# Altium schematic sheet Gate_Driver.SchDoc
size A3
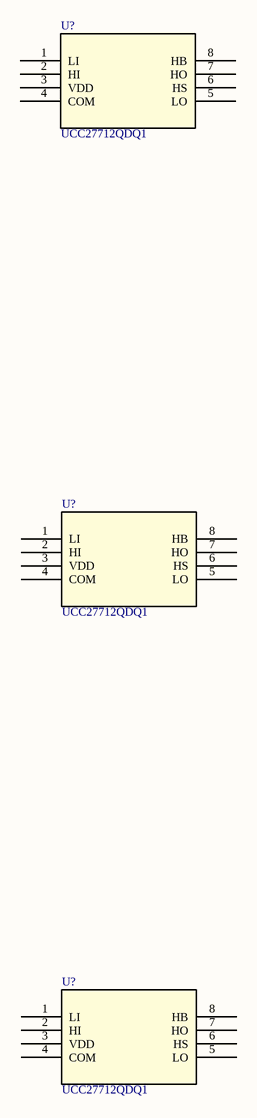
[diagram p0: Gate_Driver.SchDoc]

## Parts
(Parts that share a designator on the sheet are numbered #1, #2 ... from top to bottom, then left to right.)
U?#1  UCC27712QDQ1  [SOIC127P570X175_HS-9N]
U?#2  UCC27712QDQ1  [SOIC127P570X175_HS-9N]
U?#3  UCC27712QDQ1  [SOIC127P570X175_HS-9N]

## Nets

Not connected (* = marked no-connect by the designer): U?#1 1(LI) 2(HI) 3(VDD) 4(COM) 5(LO) 6(HS) 7(HO) 8(HB); U?#2 1(LI) 2(HI) 3(VDD) 4(COM) 5(LO) 6(HS) 7(HO) 8(HB); U?#3 1(LI) 2(HI) 3(VDD) 4(COM) 5(LO) 6(HS) 7(HO) 8(HB)

## Library data of the parts
U?#1-U?#3 = UCC27712QDQ1: No Description Available; Vendor: Texas Instruments; Built_By: EMA_Molly; SourceLibrary: TI_2019-05-11; Manufacturer_Part_Number: UCC27712QDQ1; Copyright: Copyright (C) 2018 Accelerated Designs. All rights reserved; RefDes: RefDes; Type: DEV